# EAGLE schematic 7805-regulator (EAGLE 7.1.0)
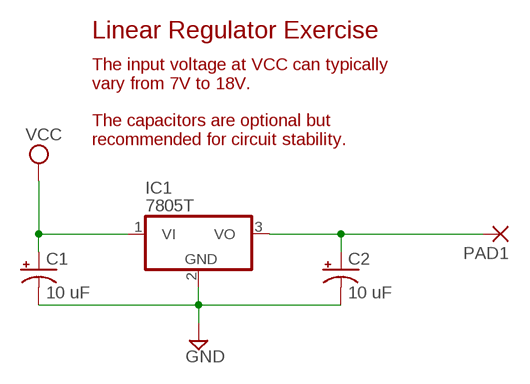
[diagram p0: schematic, sheet 1]

## Parts
C1  10 uF  CPOL-USE2.5-6  [E2,5-6]
C2  10 uF  CPOL-USE2.5-6  [E2,5-6]
IC1  7805T  [TO220H]
PAD1  WIREPAD1,6/0,9  [1,6/0,9]

## Nets
GND: C1.- C2.- IC1.2(GND)
N$2: C2.+ IC1.3(VO) PAD1.1(P)
VCC: C1.+ IC1.1(VI)

## Notes on the sheet
- Linear Regulator Exercise
- The input voltage at VCC can typically
  vary from 7V to 18V.
  
  The capacitors are optional but 
  recommended for circuit stability.

## Library data of the parts
C1 C2 = resistor:CPOL-US: POLARIZED CAPACITOR, American symbol
IC1 = linear:78*: Positive VOLTAGE REGULATOR Source: http://cache.national.com/ds/LM/LM78L05.pdf http://www.fairchildsemi.com/ds/LM/LM7805.pdf
PAD1 = wirepad:WIREPAD: Wire PAD connect wire on PCB